# EAGLE design mikroAmpMeterV150_AnalogFrontend (EAGLE 6.3)
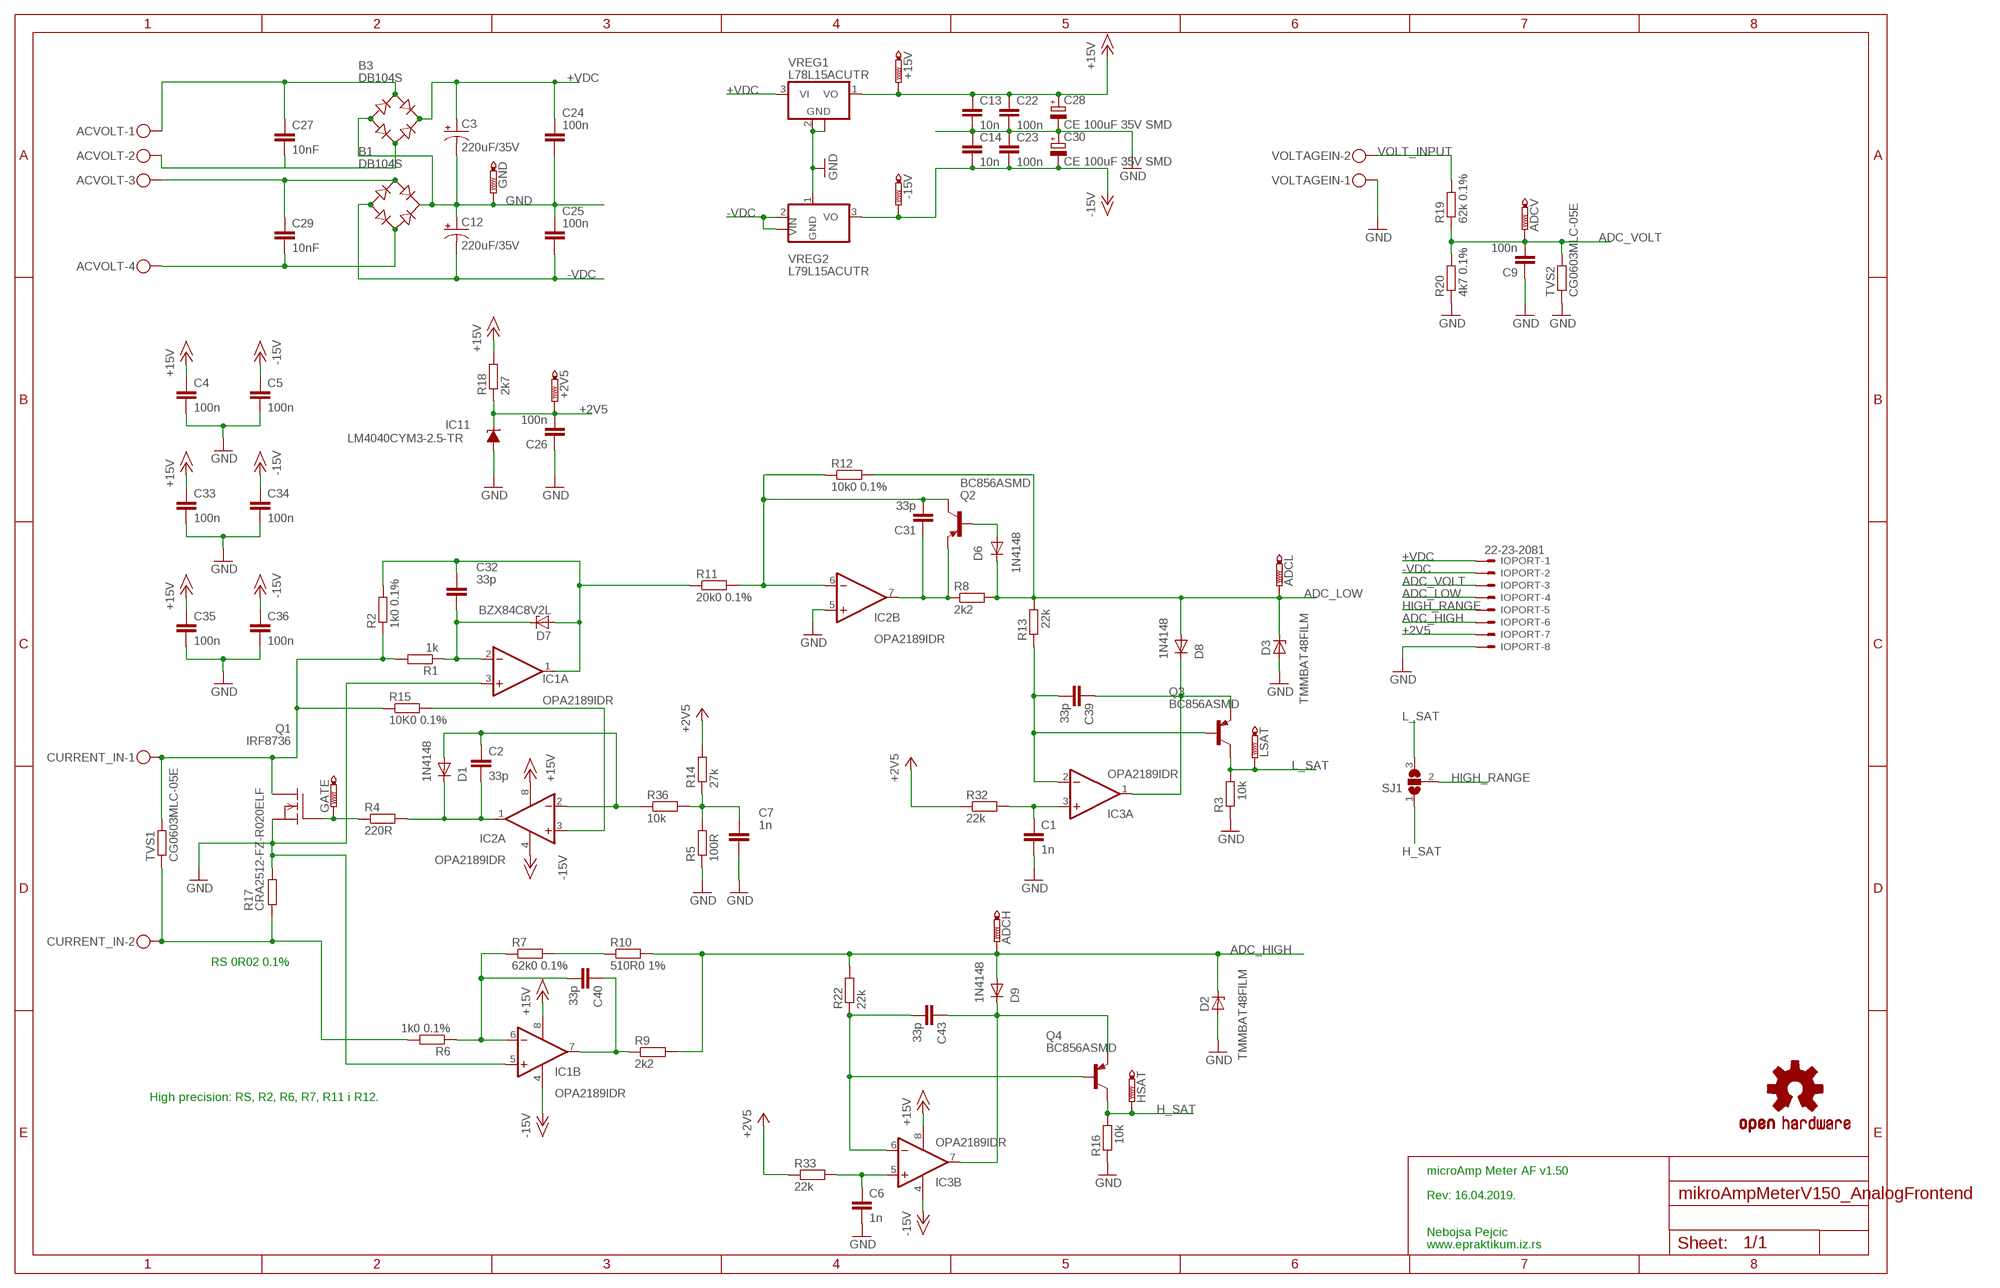
[diagram p0: schematic, sheet 1]

## Parts
+2V5  PTR1TP15R  [TP15R]
+15V  PTR1TP15R  [TP15R]
-15V  PTR1TP15R  [TP15R]
ACVOLT  MKDSN1,5/4-5,08  [MKDSN1,5/4-5,08]
ADCH  PTR1TP15R  [TP15R]
ADCL  PTR1TP15R  [TP15R]
ADCV  PTR1TP15R  [TP15R]
B1  DB104S  DBLS204G  [DBS]
B3  DB104S  DBLS204G  [DBS]
C1  1n  C-EUC0805  [C0805]
C2  33p  C-EUC0805  [C0805]
C3  220uF/35V  CPOL-US153CLV-1014  [153CLV-1014]
C4  100n  C-EUC0805  [C0805]
C5  100n  C-EUC0805  [C0805]
C6  1n  C-EUC0805  [C0805]
C7  1n  C-EUC0805  [C0805]
C9  100n  C-EUC0805  [C0805]
C12  220uF/35V  CPOL-US153CLV-1014  [153CLV-1014]
C13  10n  C-EUC0805  [C0805]
C14  10n  C-EUC0805  [C0805]
C22  100n  C-EUC0805  [C0805]
C23  100n  C-EUC0805  [C0805]
C24  100n  C-EUC0805  [C0805]
C25  100n  C-EUC0805  [C0805]
C26  100n  C-EUC0805  [C0805]
C27  10nF  C-EUC1206  [C1206]
C28  CE 100uF 35V SMD  CPOL-EUUD-6,3X7,7  [UD-6,3X7,7_NICHICON]
C29  10nF  C-EUC1206  [C1206]
C30  CE 100uF 35V SMD  CPOL-EUUD-6,3X7,7  [UD-6,3X7,7_NICHICON]
C31  33p  C-EUC0805  [C0805]
C32  33p  C-EUC0805  [C0805]
C33  100n  C-EUC0805  [C0805]
C34  100n  C-EUC0805  [C0805]
C35  100n  C-EUC0805  [C0805]
C36  100n  C-EUC0805  [C0805]
C39  33p  C-EUC0805  [C0805]
C40  33p  C-EUC0805  [C0805]
C43  33p  C-EUC0805  [C0805]
CURRENT_IN  MKDSN1,5/2-5,08  [MKDSN1,5/2-5,08]
D1  1N4148  DIODE-SOD80C  [SOD80C]
D2  TMMBAT48FILM  ZENER-DIODESOD80C  [SOD80C]
D3  TMMBAT48FILM  ZENER-DIODESOD80C  [SOD80C]
D6  1N4148  DIODE-SOD80C  [SOD80C]
D7  BZX84C8V2L  ZENER-DIODESOD80C  [SOD80C]
D8  1N4148  DIODE-SOD80C  [SOD80C]
D9  1N4148  DIODE-SOD80C  [SOD80C]
GATE  PTR1TP15R  [TP15R]
GND  PTR1TP15R  [TP15R]
HSAT  PTR1TP15R  [TP15R]
IC1  OPA2189IDR  OPA2227D  [SO08@1]
IC2  OPA2189IDR  OPA2227D  [SO08@1]
IC3  OPA2189IDR  OPA2227D  [SO08@1]
IC11  LM4040CYM3-2.5-TR  LM4041A12DBZ  [DBZ_R-PDSO-G3]
IOPORT  22-23-2081  [22-23-2081]
LOGO1  OSHW-LOGOM  [OSHW-LOGO-M]
LSAT  PTR1TP15R  [TP15R]
Q1  IRF8736  FDS5680  [SO-8]
Q2  BC856ASMD  [SOT23-BEC]
Q3  BC856ASMD  [SOT23-BEC]
Q4  BC856ASMD  [SOT23-BEC]
R1  1k  R-EU_R0805  [R0805]
R2  1k0 0.1%  R-EU_R0805  [R0805]
R3  10k  R-EU_R0805  [R0805]
R4  220R  R-EU_R0805  [R0805]
R5  100R  R-EU_R0805  [R0805]
R6  1k0 0.1%  R-EU_R0805  [R0805]
R7  62k0 0.1%  R-EU_R0805  [R0805]
R8  2k2  R-EU_R0805  [R0805]
R9  2k2  R-EU_R0805  [R0805]
R10  510R0 1%  R-EU_R0805  [R0805]
R11  20k0 0.1%  R-EU_R0805  [R0805]
R12  10k0 0.1%  R-EU_R0805  [R0805]
R13  22k  R-EU_R0805  [R0805]
R14  27k  R-EU_R0805  [R0805]
R15  10K0 0.1%  R-EU_R0805  [R0805]
R16  10k  R-EU_R0805  [R0805]
R17  CRA2512-FZ-R020ELF  R-EU_R2512  [R2512]
R18  2k7  R-EU_R0805  [R0805]
R19  62k 0.1%  R-EU_R0805  [R0805]
R20  4k7 0.1%  R-EU_R0805  [R0805]
R22  22k  R-EU_R0805  [R0805]
R32  22k  R-EU_R0805  [R0805]
R33  22k  R-EU_R0805  [R0805]
R36  10k  R-EU_R0805  [R0805]
SJ1  SJ2W  [SJ_2]
TVS1  CG0603MLC-05E  R-EU_R0805  [R0805]
TVS2  CG0603MLC-05E  R-EU_R0805  [R0805]
VOLTAGEIN  MKDSN1,5/2-5,08  [MKDSN1,5/2-5,08]
VREG1  L78L15ACUTR  78L05F  [SOT89]
VREG2  L79L15ACUTR  [SOT89]

## Nets
+2V5: +2V5.TP C26.2 IC11.1(C) IOPORT.7 R14.2 R18.1 R32.1 R33.1
+15V: +15V.TP C4.1 C13.1 C22.1 C28.+ C33.1 C35.1 IC1.8(P:V+) IC2.8(P:V+) IC3.8(P:V+) R18.2 VREG1.1(VO)
+VDC: B3.+ C3.+ C24.2 IOPORT.1 VREG1.3(VI)
-15V: -15V.TP C5.1 C14.2 C23.2 C30.- C34.1 C36.1 IC1.4(P:V-) IC2.4(P:V-) IC3.4(P:V-) VREG2.3(VO)
-VDC: B1.- C12.- C25.1 IOPORT.2 VREG2.2(VIN) VREG2.2@1(VIN)
ADC_HIGH: ADCH.TP D2.C D9.A IOPORT.6 R9.2 R10.2 R22.2
ADC_LOW: ADCL.TP D3.C D6.C D8.A IOPORT.4 R8.2 R12.2 R13.2
ADC_VOLT: ADCV.TP C9.2 IOPORT.3 R19.1 R20.2 TVS2.2
CIN+: CURRENT_IN.1 Q1.5(D) Q1.6(D) Q1.7(D) Q1.8(D) R1.2 R2.1 R15.1 TVS1.2
CIN-: CURRENT_IN.2 R6.2 R17.1 TVS1.1
GND: B1.+ B3.- C1.2 C3.- C4.2 C5.2 C6.2 C7.2 C9.1 C12.+ C13.2 C14.1 C22.2 C23.1 C24.1 C25.2 C26.1 C28.- C30.+ C33.2 C34.2 C35.2 C36.2 D2.A D3.A GND.TP IC1.3(A:+IN) IC1.5(B:+IN) IC2.5(B:+IN) IC11.2(A) IOPORT.8 Q1.1(S) Q1.2(S) Q1.3(S) R3.1 R5.1 R16.1 R17.2 R20.1 TVS2.1 VOLTAGEIN.1 VREG1.2(GND) VREG1.2@1(GND) VREG2.1(GND)
H_SAT: HSAT.TP Q4.C R16.2 SJ1.1
HIGH_RANGE: IOPORT.5 SJ1.2
L_SAT: LSAT.TP Q3.C R3.2 SJ1.3
N$1: C7.1 R5.2 R14.1 R36.2
N$2: C32.2 D7.C IC1.2(A:-IN) R1.1
N$3: C2.1 D1.A IC2.2(A:-IN) R36.1
N$5: D6.A Q2.B
N$6: IC2.3(A:+IN) R15.2
N$7: C43.2 IC3.6(B:-IN) Q4.B R22.1
N$18: C32.1 D7.A IC1.1(A:OUT) R2.2 R11.1
N$19: C31.2 IC2.6(B:-IN) Q2.C R11.2 R12.1
N$21: C31.1 IC2.7(B:OUT) Q2.E R8.1
N$22: C39.2 IC3.2(A:-IN) Q3.B R13.1
N$26: ACVOLT.1 B3.AC1 C27.2
N$28: ACVOLT.2 B3.AC2 C27.1
N$29: ACVOLT.3 B1.AC1 C29.2
N$30: ACVOLT.4 B1.AC2 C29.1
N$39: GATE.TP Q1.4(G) R4.1
N$40: C2.2 D1.C IC2.1(A:OUT) R4.2
N$47: C39.1 D8.C IC3.1(A:OUT) Q3.E
N$48: C40.2 IC1.6(B:-IN) R6.1 R7.1
N$49: R7.2 R10.1
N$50: C40.1 IC1.7(B:OUT) R9.1
N$53: C43.1 D9.C IC3.7(B:OUT) Q4.E
N$55: C6.1 IC3.5(B:+IN) R33.2
N$56: C1.1 IC3.3(A:+IN) R32.2
VOLT_INPUT: R19.2 VOLTAGEIN.2

## Notes on the sheet
- RS 0R02 0.1%
- High precision: RS, R2, R6, R7, R11 i R12.
- microAmp Meter AF v1.50
- Rev: 16.04.2019.
- Nebojsa Pejcic
- www.epraktikum.iz.rs

## Library data of the parts
+2V5 +15V -15V ADCH ADCL ADCV GATE GND HSAT LSAT = testpad:PTR1: TEST PIN
ACVOLT = con-phoenix-508:MKDSN1,5/4-5,08: MKDSN 1,5/ 4-5,08 Printklemme Nennstrom: 13,5 A Nennspannung: 250 V Rastermaß: 5,08 mm Polzahl: 4 Anschlussart: Schraubanschluss Montage: Löten Anschlussrichtung Leiter/Platine: 0 ° Artikelnummer: 1729144 Source: http://eshop.phoenixcontact.com .. 1729144.pdf; MPN: SMKDSN1,5/4-5,08; OC_FARNELL: 1792905; OC_NEWARK: 70R0300
B1 B3 = rectifier:DB?*G: Single Phase 1.0 AMP Glass Passivated Bridge Rectifier Taiwan Semiconductor Co.,Ltd. - TSC Source: http://www.taiwansemi.com/TSCbig5/ezcatfiles/cust/img/img/db101g.pdf http://www.ts.com.tw/db/pictures/modules/PDT/PDT060207001/DBLS201G.pdf
C1 C2 C4-C7 C9 C13 C14 C22-C27 C29 C31-C36 C39 C40 C43 = rcl:C-EU: CAPACITOR, European symbol
C3 C12 = rcl:CPOL-US: POLARIZED CAPACITOR, American symbol
C28 C30 = rcl:CPOL-EU: POLARIZED CAPACITOR, European symbol
CURRENT_IN VOLTAGEIN = con-phoenix-508:MKDSN1,5/2-5,08: MKDSN 1,5/ 2-5,08 Printklemme Nennstrom: 13,5 A Nennspannung: 250 V Rastermaß: 5,08 mm Polzahl: 2 Anschlussart: Schraubanschluss Montage: Löten Anschlussrichtung Leiter/Platine: 0 ° Artikelnummer: 1729128 Source: http://eshop.phoenixcontact.com .. 1729128.pdf; MPN: MKDSN 1,5/2-5.08; OC_FARNELL: 1792903; OC_NEWARK: 30M2397
D1 D6 D8 D9 = diode:DIODE-: DIODE
D2 D3 D7 = diode:ZENER-DIODE: Z-Diode
IC1-IC3 = linear:OPA222*: High Precision, Low Noise OPERATIONAL AMPLIFIERS Source: http://focus.ti.com/lit/ds/symlink/opa227.pdf
IC11 = texas:LM4041: PRECISION MICROPOWER SHUNT VOLTAGE REFERENCE Source: http://focus.ti.com/lit/ds/slcs146e/slcs146e.pdf; MPN: LM4041A12IDBZR; OC_FARNELL: 1407949; OC_NEWARK: 58K5875
IOPORT = con-molex:22-23-2081: .100" (2.54mm) Center Header - 8 Pin; MF: MOLEX; MPN: 22-23-2081; OC_FARNELL: 1756826; OC_NEWARK: 01C7592
LOGO1 = SparkFun-Aesthetics:OSHW-LOGO: Open Source Hardware Logo This logo indicates the piece of hardware it is found on incorporates a OSHW license and/or adheres to the definition of open source hardware found here: http://freedomdefined.org/OSHW
Q1 = transistor-fet:FDS5680: 60V N-Channel PowerTrench TM MOSFET FAIRCHILD FDS5680.pdf
Q2-Q4 = transistor-pnp:BC856*: PNP Transistror
R1-R20 R22 R32 R33 R36 TVS1 TVS2 = rcl:R-EU_: RESISTOR, European symbol
SJ1 = jumper:SJ2W: SMD solder JUMPER
VREG1 = linear:78L*: POSITOIV-VOLTAGE REGULATORS Output up to 100 mA Source: http://focus.ti.com/lit/ds/symlink/ua78l05.pdf
VREG2 = linear:L79L15ACUTR

## Board
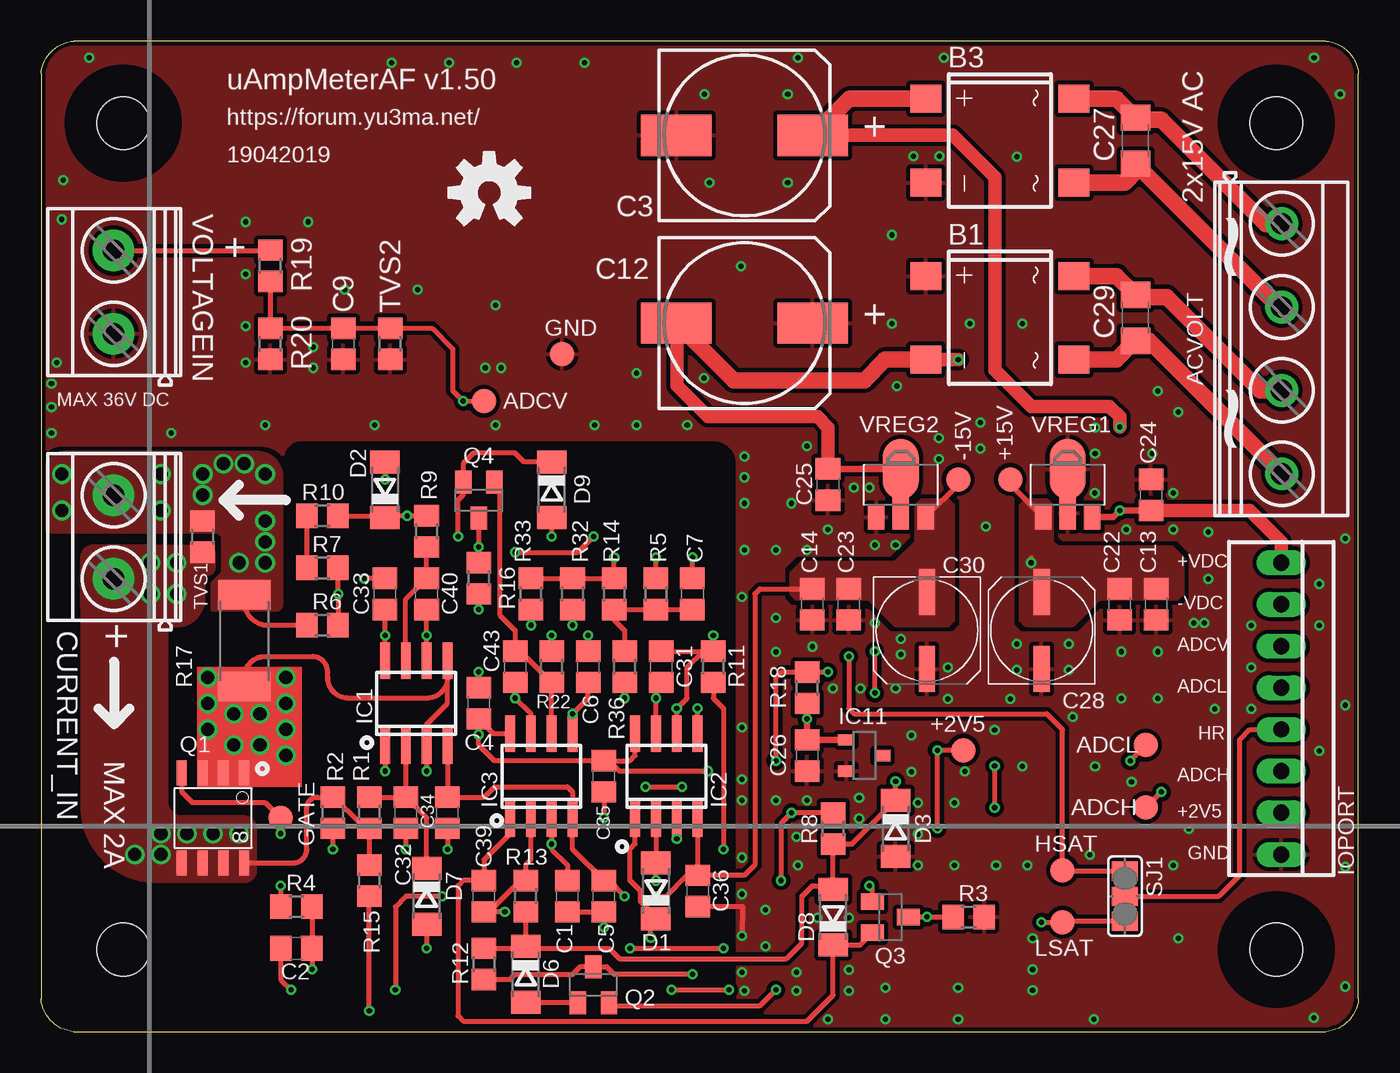
[diagram p1: board, top side]
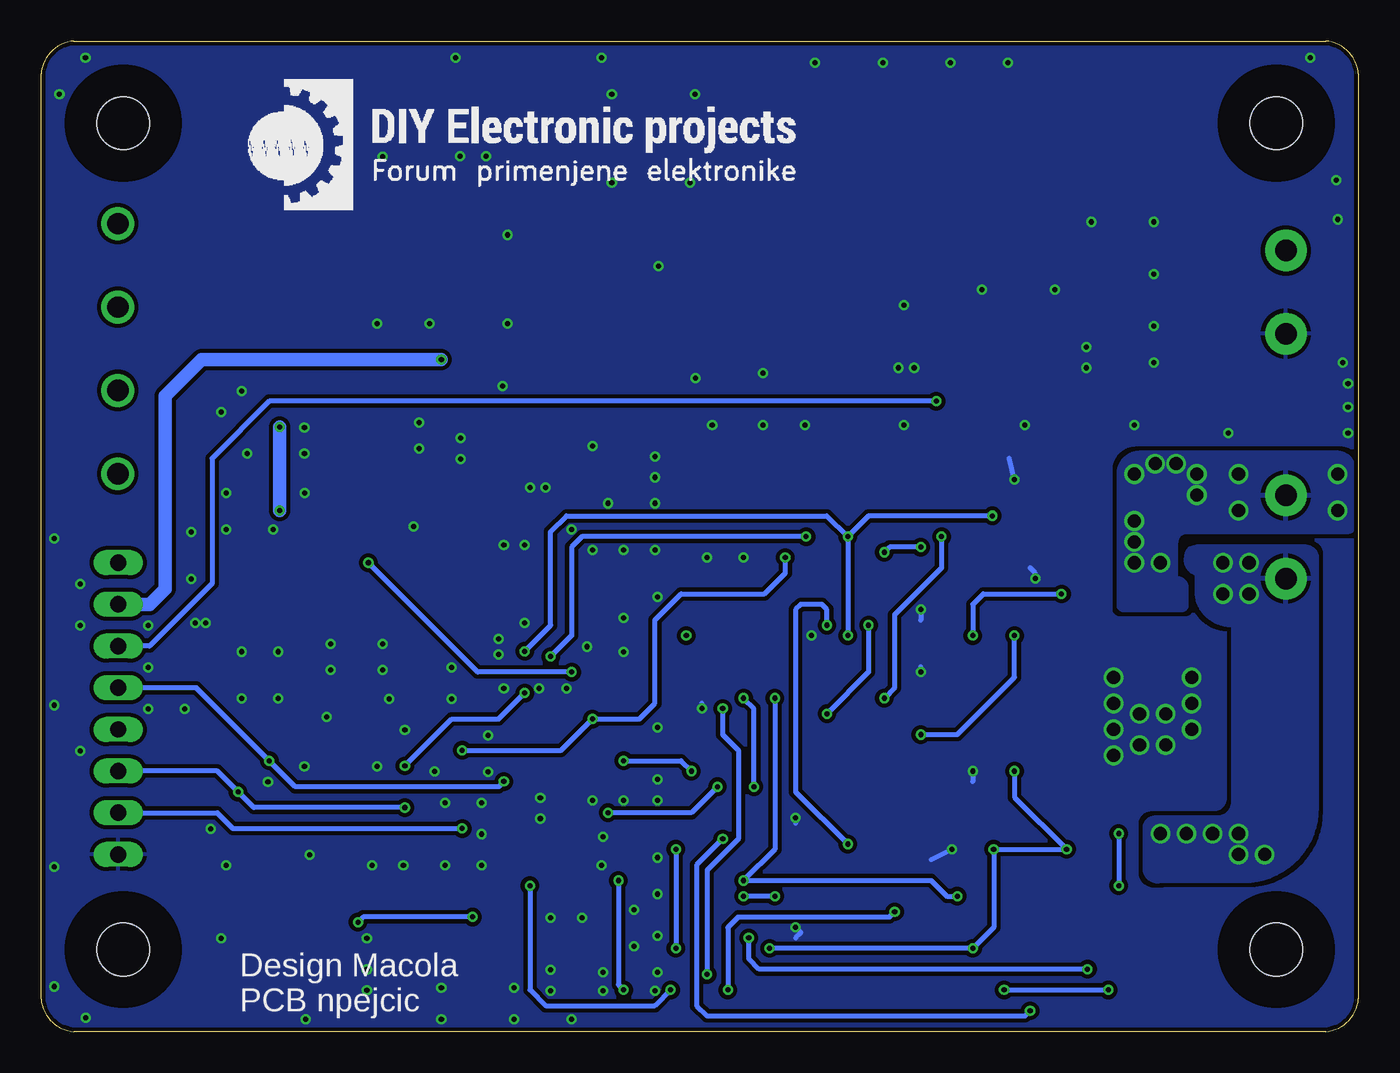
[diagram p2: board, bottom side, seen from below]

Size 80.27 x 60.36 mm. Coordinates in mm from the lower left corner, seen from the top.
Outline: 2,0 78.27,0 arc81 80.27,2 80.27,58.36 arc81 78.27,60.36 2,60.36 arc81 0,58.36 0,2 arc81 2,0
Copper layers (1*16): Top 0.035mm / dielectric 1.5mm / Bottom 0.035mm
Design rules "ITEADstudio_DRC": minimum track width 6mil, minimum drill 12mil, track to track 6mil, track to pad 6mil, pad to pad 6mil, via to via 6mil, smd to smd 0mil, copper to edge 10mil, drill to drill 10mil, minimum pad ring 10mil, minimum via ring 6mil, stop-mask expansion 2mil, vias tented up to drill 100mil, thermal gap 10mil
Holes 3.2 mm at 75.27,55.36 5,55.36 75.27,5 5,5
tRestrict: area 2,2 to 8,8; area 72.3,52.4 to 78.3,58.4; area 2,52.4 to 8,58.4; area 72.3,2 to 78.3,8; area 8.3,0 to 41.9,35.6
bRestrict: area 2,2 to 8,8; area 72.3,52.4 to 78.3,58.4; area 2,52.4 to 8,58.4; area 72.3,2 to 78.3,8

### Footprints (pad centres in the part's own frame; a part is rotated, then mirrored left to right if it is on the bottom)
TP15R = smd 1.5 x 1.5: TP 0,0
MKDSN1,5/4-5,08 = drill 1.3 pad 2: 1 -7.641,0.025; 2 -2.561,0.025; 3 2.519,0.025; 4 7.599,0.025
DBS = smd 1.7 x 1.9: + -2.55,-4.5; - 2.55,-4.5; AC1 -2.55,4.5; AC2 2.55,4.5
C0805 = smd 1.3 x 1.5: 1 -0.95,0; 2 0.95,0
153CLV-1014 = smd 4.3 x 2.5: + 4.15,0; - -4.15,0
C1206 = smd 1.6 x 1.8: 1 -1.4,0; 2 1.4,0
UD-6,3X7,7_NICHICON = smd 2.8 x 1: + 2.35,0; - -2.35,0
MKDSN1,5/2-5,08 = drill 1.3 pad 2.54: 1 -2.561,0.025; 2 2.519,0.025
SOD80C = smd 1.4 x 1.8: A 1.7,0; C -1.7,0
SO08@1 = smd 0.6 x 2.2: 1 -1.905,-2.6; 2 -0.635,-2.6; 3 0.635,-2.6; 4 1.905,-2.6; 5 1.905,2.6; 6 0.635,2.6; 7 -0.635,2.6; 8 -1.905,2.6
DBZ_R-PDSO-G3 = smd 0.7 x 1: 1 -0.95,-1.1; 2 0.95,-1.1; 3 0,1.1
22-23-2081 = drill 1 long: 1 -8.89,0; 2 -6.35,0; 3 -3.81,0; 4 -1.27,0; 5 1.27,0; 6 3.81,0; 7 6.35,0; 8 8.89,0
SO-8 = smd 1.524 x 0.61: 1 -2.743,1.905; 2 -2.743,0.635; 3 -2.743,-0.635; 4 -2.743,-1.905; 5 2.743,-1.905; 6 2.743,-0.635; 7 2.743,0.635; 8 2.743,1.905
SOT23-BEC = smd 1 x 1.4: B -0.95,-1.1; C 0,1.1; E 0.95,-1.1
R0805 = smd 1.3 x 1.5: 1 -0.95,0; 2 0.95,0
R2512 = smd 1.8 x 3.2: 1 -2.8,0; 2 2.8,0
SJ_2 = smd 1.168 x 1.6: 1 -1.524,0; 2 0,0; 3 1.524,0
SOT89 = smd 1 x 1.5: 1 -1.499,-1.981; 3 1.499,-1.981 | smd 1 x 2: 2 0,-1.727 | smd 2.2 x 3.7: 2@1 0,0.94

### Placement (x,y rotation side)
+2V5  56.2,17.14 0 top
+15V  59.05,33.66 0 top
-15V  55.88,33.66 0 top
ACVOLT  75.56,41.59 270 top
ADCH  67.31,13.65 0 top
ADCL  67.31,17.46 0 top
ADCV  26.99,38.42 0 top
B1  58.42,43.5 270 top
B3  58.42,54.29 270 top
C1  32.07,8.26 270 top
C2  15.56,5.08 0 top
C3  42.86,54.61 0 top
C4  26.67,20 90 top
C5  34.29,8.26 270 top
C6  33.34,22.23 90 top
C7  39.69,26.67 90 top
C9  18.41,41.91 90 top
C12  42.86,43.18 0 top
C13  67.94,26.04 270 top
C14  46.99,26.04 90 top
C22  65.72,26.04 270 top
C23  49.21,26.04 90 top
C24  67.63,32.7 270 top
C25  47.94,33.34 270 top
C26  46.67,16.83 90 top
C27  66.67,54.29 90 top
C28  60.96,24.45 90 top
C29  66.67,43.5 90 top
C30  53.98,24.45 270 top
C31  37.78,22.23 90 top
C32  22.23,13.34 90 top
C33  20.95,26.67 90 top
C34  24.77,13.34 270 top
C35  34.29,15.56 270 top
C36  40.01,8.57 270 top
C39  26.99,8.26 270 top
C40  23.5,26.67 270 top
C43  28.89,22.23 90 top
CURRENT_IN  4.45,30.16 90 top
D1  37.47,8.57 90 top
D2  20.95,33.02 90 top
D3  52.07,12.38 270 top
D6  29.53,3.49 270 top
D7  23.5,8.26 270 top
D8  48.26,6.99 90 top
D9  31.11,33.02 270 top
GATE  14.61,13.02 0 top
GND  31.75,41.27 0 top
HSAT  62.23,9.84 0 top
IC1  22.86,20 0 top
IC2  38.1,15.56 0 top
IC3  30.48,15.56 0 top
IC11  50.16,16.83 270 top
IOPORT  75.56,19.68 270 top
LOGO1  27.3,51.12 0 top
LSAT  62.23,6.67 90 top
Q1  10.48,13.02 270 top
Q2  33.66,2.86 0 top
Q3  51.75,6.99 270 top
Q4  26.67,32.38 180 top
R1  20,13.34 270 top
R2  17.78,13.34 270 top
R3  56.52,6.99 180 top
R4  15.56,7.62 0 top
R5  37.47,26.67 270 top
R6  17.14,24.77 180 top
R7  17.14,28.26 180 top
R8  48.26,12.38 270 top
R9  23.5,30.48 90 top
R10  17.14,31.43 0 top
R11  40.96,22.23 90 top
R12  26.99,4.13 90 top
R13  29.53,8.26 270 top
R14  34.92,26.67 90 top
R15  20,9.21 270 top
R16  26.67,27.62 90 top
R17  12.38,23.81 270 top
R18  46.67,20.95 90 top
R19  13.97,46.67 90 top
R20  13.97,41.91 90 top
R22  31.11,22.23 90 top
R32  32.38,26.67 270 top
R33  29.84,26.67 270 top
R36  35.56,22.23 90 top
SJ1  66.04,8.26 270 top
TVS1  9.84,30.16 270 top
TVS2  21.27,41.91 90 top
VOLTAGEIN  4.45,45.09 90 top
VREG1  62.55,33.34 0 top
VREG2  52.39,33.34 0 top

### Tracks (layer width: path | path; a pad name or v marks a point on that pad's centre or on a via)
+2V5  (via drill 0.31)
  Top 0.305: R18.1 | v54.61,12.38 v54.61,17.14 +2V5.TP | 34.6,27.62 R14.2 | R33.1 R32.1 R14.2 | R14.2 v34.92,28.89
  Top 0.406: R18.1 v46.67,19.05 C26.2 IC11.1
  Bottom 0.305: v34.92,28.89 34.92,27.94 36.2,26.67 41.27,26.67 42.86,25.08 42.86,20 43.81,19.05 v46.67,19.05 48.58,17.14 v54.61,17.14 | IOPORT.7 69.53,13.34 68.58,12.38 v54.61,12.38
+15V  (via drill 0.31)
  Top 0.305: C33.1 v20.95,24.13 IC1.8 | v44.77,16.51 44.77,16.82 44.77,21.59 45.09,21.91 R18.2 v47.94,21.91 | v60.33,28.57 60.33,28.89 | +15V.TP 59.05,33.35 VREG1.1 | IC3.8 27.57,18.16 C4.1 v26.67,18.1 26.67,17.46 27.62,16.51 C35.1 | C35.1 35.88,16.51 36.2,16.83 IC2.8 | C35.1 34.61,16.51 35.24,15.88 v40.64,15.88
  Bottom 0.305: v47.94,21.91 53.66,21.91 v60.33,28.57 | v44.77,16.51 41.27,16.51 v40.64,15.88 | v26.67,18.1 24.45,18.1 20.95,21.59 v20.95,24.13
  pour Top (isolate 0.254, no thermals): 62.87,24.77 60.01,24.77 59.69,25.08 59.69,32.07 60.01,32.38 61.28,32.38 61.59,32.07 61.59,29.84 61.91,29.53 68.9,29.53 69.53,28.89 69.53,26.67 69.22,26.35 64.45,26.35
+VDC  (via drill 0.31)
  Top 0.406: VREG1.3 65.33,31.36 v65.72,31.75 C24.2
  Top 0.813: C24.2 73.66,31.75 75.56,29.84 IOPORT.1 | v65.72,36.83 65.72,37.47 65.09,38.1 60.33,38.1 58.1,40.32 58.1,52.07 55.56,54.61 C3.+
  Top 1.016: B3.+ 49.24,56.84 C3.+
  Bottom 0.813: v65.72,31.75 v65.72,36.83
-15V  (via drill 0.31)
  Top 0.305: IC1.4 C34.1 26.98,14.29 27.62,14.92 32.07,14.92 32.38,14.61 IC3.4 32.38,11.11 C5.1 34.61,9.21 v35.56,8.26 | C14.2 46.35,26.99 43.81,26.99 43.5,26.67 43.5,10.16 42.86,9.53 C36.1 | -15V.TP 55.88,33.35 VREG2.3 | IC2.4 C36.1 | v37.47,8.26 38.1,8.26 39.37,9.53 C36.1
  Bottom 0.305: v35.56,8.26 v37.47,8.26
  pour Top (isolate 0.254, no thermals): 45.72,26.67 45.72,27.94 46.35,28.57 52.07,28.57 53.34,29.84 53.34,32.07 53.66,32.38 55.24,32.38 55.56,32.07 55.56,25.08 55.24,24.77 52.07,24.77 50.48,26.35 46.04,26.35
-VDC  (via drill 0.31)
  Top 0.305: VREG2.2@1 VREG2.2
  Top 0.406: VREG2.2@1 47.96,34.28 C25.1
  Top 0.813: 47.96,34.28 47.96,36.81 47.31,37.47 40.64,37.47 38.73,39.37 38.73,43.16 C12.- | v55.88,40.96 B1.-
  Top 1.016: B1.- 51.42,40.95 50.16,39.69 42.2,39.69 C12.-
  Bottom 0.813: v55.88,40.96 70.48,40.96 72.71,38.73 72.71,26.99 73.66,26.04 IOPORT.2
ADC_HIGH  (via drill 0.31)
  Top 0.305: R9.2 | ADCH.TP v68.26,14.61 | R9.2 | R9.2 v22.3,31.43 | v31.11,24.13 R22.2 | v58.1,13.65 v58.1,16.19 | v50.8,20.64 v50.8,23.18 | D9.A v31.11,30.16 | R10.2 20.84,31.43 D2.C 21.07,31.43 R9.2 | R9.2
  Bottom 0.305: IOPORT.6 69.53,15.88 v68.26,14.61 ADCH.TP v58.1,13.65 | v22.3,31.43 29.84,31.43 v31.11,30.16 | v31.11,30.16 v31.11,24.13 | v58.1,16.19 55.24,19.05 52.39,19.05 v50.8,20.64 | v50.8,23.18 49.21,24.77 49.21,30.48 48.26,31.43 32.38,31.43 v31.11,30.16
ADC_LOW  (via drill 0.31)
  Top 0.305: R12.2 30.36,5.08 | 30.36,5.08 D6.C R13.2 | 30.36,5.08 34.61,5.08 35.24,4.45 45.4,4.45 46.35,5.4 46.35,8.26 46.99,8.89 48.15,8.89 D8.A R8.2 49.42,11.43 D3.C v52.07,15.24 | v66.36,16.51 ADCL.TP
  Bottom 0.305: v52.07,15.24 52.39,14.92 64.77,14.92 v66.36,16.51 70.8,20.95 IOPORT.4
ADC_VOLT  (via drill 0.31)
  Top 0.305: R19.1 R20.2 C9.2 TVS2.2 23.82,42.86 25.08,41.59 25.08,39.05 v25.72,38.42 ADCV.TP
  Bottom 0.305: v25.72,38.42 66.36,38.42 69.85,34.92 69.85,27.3 73.66,23.5 IOPORT.3
CIN+  (via drill 0.8)
  Top 0.305: Q1.8 15.35,10.27 arc90 16.19,11.11 16.19,13.65 arc-90 16.83,14.29 R2.1 arc-90 R2.1 17.86,14.29 19.37,12.78 19.61,12.78 R1.2 R15.1
  other vias: 7.3,10.79 5.71,10.79 8.89,12.06 10.48,12.06 12.06,12.06 7.3,12.06 6.67,28.57 8.26,28.57 6.67,26.67 8.26,26.67
  pour Bottom: 12.06,9.21 6.99,9.21 arc-90 2.54,13.65 2.54,28.82 arc-90 3.25,29.53 9.84,29.53 10.27,29.42 arc-45 10.48,28.92 10.48,28.89 arc-90 9.84,27.94 9.84,26.67 arc-90 7.62,24.82 7.62,13.97 arc90 8.57,13.02 12.38,13.02 arc-90 13.02,12.38 13.02,9.84 arc-90
  pour Top (no thermals): 2.54,26.04 2.54,28.89 arc-90 3.17,29.53 10.16,29.53 arc-90 10.48,29.21 10.48,28.26 arc-90 10.16,27.94 arc90 9.84,27.62 9.84,26.35 arc-90 8.26,24.77 3.81,24.77 arc-90
  pour Top (no thermals): 2.54,28.89 2.54,13.86 arc90 6.87,9.21 12.38,9.21 arc90 13.02,9.84 13.02,12.38 arc90 12.38,13.02 8.57,13.02 arc-90 7.62,13.97 7.62,28.26 arc90 6.35,29.53 3.17,29.53 arc90
CIN-  (via drill 0.8)
  Top 0.305: R6.2 13.6,24.77 arc-90 R17.1
  Top 1.27: TVS1.1
  Top 1.676: 12.32,26.67 R17.1
  other vias: 1.27,33.97 1.27,31.75 7.3,31.75 7.3,33.97 9.84,33.97 9.84,32.7 11.11,34.61 12.06,28.57 13.65,28.57 13.65,29.84 13.65,31.11 13.65,33.97 12.38,34.61
  pour Top (no thermals): 10.48,27.3 11.11,27.94 11.11,30.16 10.79,30.48 0.64,30.48 arc-90 0.32,30.8 0.32,34.1 arc-90 1.46,35.24 13.19,35.24 arc-90 14.61,33.82 14.61,26.04 arc-90 14.29,25.72 10.48,25.72
  pour Bottom: 0.32,30.8 0.32,34.29 arc-90 1.27,35.24 13.34,35.24 arc-90 14.61,33.97 14.61,26.04 arc-90 14.29,25.72 10.79,25.72 arc-90 10.48,26.04 10.48,26.99 arc-90 11.11,27.62 11.11,29.84 arc90 10.48,30.48 0.64,30.48 arc-90
GND  (via drill 0.31, 0.8)
  Top 0.305: R17.2 12.38,21.59 arc-90 13.65,22.86 16.51,22.86 arc-90 17.46,21.91 17.46,21.59 arc90 18.73,20.32 23.5,20.32 arc90 24.77,21.59 | IC1.5 24.77,21.59 | 24.77,21.59 24.77,20 23.5,18.73 IC1.3 v23.5,15.88 | C33.2 v19.69,27.62 v19.68,27.62 | C34.2 v24.77,11.11 | D2.A v20.95,33.66 | Q1.3 Q1.2 | C4.2 v26.67,21.91 | R16.1 v26.67,25.72 | C6.2 v33.34,24.13 | v34.29,6.35 C5.2 C1.2 | R5.1 v37.47,28.89 | C7.2 v39.69,28.89 | IC2.5 v40.01,19.68 | C36.2 42.74,7.62 v42.7,5.84 | C35.2 v34.29,13.02
  Top 1.676: Q1.2 Q1.1 R17.2
  Bottom 0.305: v34.29,6.35 33.97,6.03 34.29,5.71 | v23.5,15.88 23.5,15.24 | v19.68,27.62 19.68,27.94 20,28.26 | v24.77,11.11 26.04,10.48 | v20.95,33.66 21.27,34.92 | v26.67,21.91 26.67,22.23 | v26.67,25.72 26.67,25.08 | v40.01,19.68 40.01,20 | v34.29,13.02 34.29,12.7
  other vias: 46.67,29.34 50.8,29.65 46.67,35.69 42.86,29.34 45.72,32.19 39.37,36.96 0.64,39.5 27.7,36.96 42.86,35.05 52.07,29.65 2.95,59.35 0.95,40.77 1.27,49.49 0.64,38.06 0.64,36.47 33.73,36.96 50.48,33.15 44.77,29.34 42.86,33.78 49.53,33.15 42.86,32.19 53.15,53.34 54.74,53.34 33.11,59.03 28.98,59.03 24.85,59.03 21.36,59.03 46.13,59.35 55.02,59.35 77.56,59.35 79.15,57.12 42.7,26.48 44.77,25.21 44.77,14.1 62.87,19.18 52.39,23.94 52.39,22.99 50.8,24.89 42.7,18.54 42.7,15.37 42.7,14.1 42.7,10.6 46.67,14.1 46.04,11.87 42.7,8.38 44.13,7.43 44.13,5.21 42.7,3.62 77.55,0.84 79.45,2.75 79.45,10.05 79.45,19.89 79.45,30.05 20.32,36.96 13.65,36.96 46.04,3.62 47.94,0.76 51.44,0.76 55.88,0.76 64.14,0.76 40.73,51.73 45.49,51.73 45.49,57.12 40.41,57.12 51.84,48.55 51.84,43.15 56.6,43.15 59.78,43.15 59.46,53.31 42.63,46.65 52.16,39.34 54.7,36.17 54.7,34.9 57.56,30.77 57.24,37.12 57.24,35.53 64.22,36.8 64.22,35.22 67.72,35.22 68.03,39.03 69.3,37.76 65.81,23.15 68.03,23.15 68.03,20.29 65.81,20.29 56.29,15.85 59.78,16.17 64.22,16.17 71.53,19.66 73.75,19.66 73.75,22.2 73.75,24.74 77.88,27.28 77.88,24.74 77.88,17.12 63.91,10.77 69.3,5.69 68.99,10.13 69.94,12.36 66.45,15.21 53.43,13.94 53.43,12.04 55.65,13.94 58.19,10.13 60.1,10.13 60.41,5.69 60.41,3.78 60.41,2.51 46.13,10.13 53.43,10.13 55.65,10.13 27.7,44.26 1.35,51.88 12.46,49.34 16.27,49.34 18.49,45.21 27.07,40.45 22.94,45.21 28.02,40.45 36.27,40.13 36.27,36.96 40.4,39.81 16.59,41.72 16.59,40.45 12.46,46.16 12.46,42.99 12.46,40.77 62.63,23.62 62.63,22.03 59.45,22.03 59.45,23.62 66.12,30.61 68.98,30.61 68.98,32.83 64.21,32.83 70.25,24.89 70.88,24.89 55.88,2.67 51.44,2.67 10.16,21.59 10.16,20 10.16,18.41 11.75,19.37 11.75,17.46 13.34,19.37 13.34,17.46 14.92,16.83 14.92,18.41 14.92,20 14.92,21.59 7.94,36.47 42.86,2.5 46.04,2.5 49.21,2.5 49.21,3.77 47.31,6.95 49.21,6.95 49.85,14.25 49.85,12.98 53.02,18.06 53.02,15.84 58.1,18.38 55.24,20.28 59.05,20.28 55.24,22.19 52.07,20.92 48.26,20.92 44.77,23.14 46.99,23.46 71.12,30.44 71.12,27.58 47.94,30.61 49.93,20.92
  pour Top (isolate 0.254, rank 2): -0.44,60.77 80.33,60.77 80.64,-0.32 59.37,-0.32 58.42,-0.25 -0.44,-0.25
  pour Bottom (isolate 0.254, rank 2): -0.44,60.77 -0.44,-0.25 57.47,-0.25 58.1,-0.32 80.64,-0.32 80.33,60.77
H_SAT  (via drill 0.31)
  Top 0.305: Q4.C v26.67,29.53 R16.2 | v28.89,29.21 32.7,29.21 v33.66,30.16 | v49.21,22.86 49.21,19.68 49.53,19.37 61.28,19.37 62.23,18.41 HSAT.TP 62.29,9.78 SJ1.1
  Bottom 0.305: v26.67,29.53 28.57,29.53 v28.89,29.21 | v33.66,30.16 47.31,30.16 47.94,29.53 47.94,24.13 v49.21,22.86
HIGH_RANGE
  Top 0.305: SJ1.2 71.75,8.26 73.03,9.53 73.03,17.78 73.66,18.41 IOPORT.5
L_SAT  (via drill 0.31)
  Top 0.305: Q3.C v53.98,6.99 R3.2 | v60.96,6.67 LSAT.TP 62.29,6.73 SJ1.3
  Bottom 0.305: v53.98,6.99 60.64,6.99 v60.96,6.67
N$1
  Top 0.305: R36.2 35.56,24.45 34.92,25.08 R14.1 R5.2 C7.1
N$2
  Top 0.305: IC1.2 C32.2 | R1.1 C32.2 | D7.C 23.5,13.02 C32.2
N$3  (via drill 0.31)
  Top 0.305: C2.1 14.61,3.17 v15.24,2.54 | v37.47,9.21 D1.A IC2.2 | R36.1 v35.56,20.32 | v24.45,8.26 22.23,8.26 21.59,7.62 v21.59,2.54
  Bottom 0.305: v35.56,20.32 35.56,11.11 v37.47,9.21 26.04,9.21 25.08,8.26 v24.45,8.26 | v21.59,2.54 v15.24,2.54
N$5
  Top 0.305: D6.A 32.67,1.79 Q2.B
N$6  (via drill 0.31)
  Top 0.305: IC2.3 v38.73,11.75 | v20,1.27 R15.2
  Bottom 0.305: v38.73,11.75 40.32,10.16 40.32,1.59 39.69,0.95 20.32,0.95 v20,1.27
N$7
  Top 0.305: IC3.6 R22.1 29.21,23.18 C43.2 28.89,24.45 27.94,25.4 27.94,33.02 27.62,33.34 Q4.B
N$18  (via drill 0.31)
  Top 0.305: R2.2 v17.78,11.11 | C32.1 v22.23,11.11 | 23.38,6.67 D7.A v23.5,5.08 | v35.88,5.08 v41.59,5.08 | R11.1 40.96,20.32 41.59,19.68 v41.59,11.11 | IC1.1 v20.95,15.88
  Bottom 0.305: v20.95,15.88 20.95,14.29 v17.78,11.11 v22.23,11.11 22.23,6.35 v23.5,5.08 v35.88,5.08 | v41.59,11.11 v41.59,5.08
N$19  (via drill 0.31)
  Top 0.305: v40.96,24.13 R11.2 40.32,23.18 | R12.1 28.58,3.18 28.89,3.49 32.38,3.49 32.85,3.96 Q2.C 34.46,3.96 34.92,3.49 v39.69,3.49 | C31.2 40.32,23.18 | IC2.6 v38.73,19.68 39.37,20.32 39.37,22.22 40.32,23.18
  Bottom 0.305: v38.73,19.68 38.73,18.1 37.78,17.14 37.78,11.75 39.69,9.84 v39.69,3.49
N$21  (via drill 0.31)
  Top 0.305: R8.1 46.04,13.33 | 46.04,13.33 v45.72,13.33 45.09,12.7 v45.09,9.21 | v44.77,2.54 43.81,1.59 34.77,1.59 Q2.E | IC2.7 v37.47,20.32 37.47,20.95 C31.1 | v36.83,14.92 v39.05,14.92 | v45.72,13.34 46.03,13.34 46.04,13.33
  Bottom 0.305: v37.47,20.32 36.83,19.68 v36.83,14.92 | v45.09,9.21 45.09,2.86 v44.77,2.54 | v39.05,14.92 40.64,13.34 v45.72,13.34 v45.72,13.33
N$22  (via drill 0.31)
  Top 0.305: IC3.2 29.84,10.48 29.53,10.16 R13.1 | R13.1 29.21,8.89 28.89,8.89 27.31,7.3 C39.2 v28.26,7.3 | Q3.B 50.65,8.72 v50.48,8.89 | R13.1 29.85,9.21 | v38.42,2.54 v41.91,2.54
  Bottom 0.305: v50.48,8.89 50.48,2.54 49.53,1.59 42.86,1.59 v41.91,2.54 | v38.42,2.54 38.42,6.35 37.78,6.99 28.57,6.99 v28.26,7.3
N$26
  Top 1.016: B3.AC1 65.53,56.84 C27.2 66.81,55.56 68.26,55.56 74.61,49.21 75.57,49.21 ACVOLT.1
N$28
  Top 1.016: B3.AC2 66.03,51.74 66.67,52.39 C27.1 75.44,44.13 75.57,44.13 ACVOLT.2
N$29
  Top 1.016: B1.AC1 65.53,46.05 C29.2 66.81,44.77 68.58,44.77 74.3,39.05 75.57,39.05 ACVOLT.3
N$30
  Top 1.016: B1.AC2 65.53,40.95 C29.1 67.49,42.1 ACVOLT.4
N$39  (via drill 0.31)
  Top 0.305: Q1.4 8.57,14.61 9.21,13.97 13.65,13.97 GATE.TP v14.61,12.06 | v14.61,8.89 R4.1
  Bottom 0.305: v14.61,12.06 v14.61,8.89
N$40  (via drill 0.31)
  Top 0.305: R4.2 C2.2 16.51,4.45 v16.51,3.81 | v37.15,5.71 37.15,6.55 D1.C 37.47,6.99 36.51,7.94 36.51,8.57 35.88,9.21 35.88,11.11 36.2,11.43 IC2.1
  Bottom 0.305: v16.51,3.81 36.51,3.81 37.15,4.45 v37.15,5.71
N$47
  Top 0.305: IC3.1 28.57,12.06 26.99,10.48 C39.1 | C39.1 | C39.1 25.72,9.21 25.4,8.89 25.4,0.95 25.72,0.64 46.67,0.64 48.26,2.22 D8.C 49.9,5.29 Q3.E
N$48  (via drill 0.31)
  Top 0.305: IC1.6 v23.5,24.13 C40.2 | R7.1 v18.09,26.67 R6.1
  Bottom 0.305: v23.5,24.13 23.5,26.04 22.86,26.67 v18.09,26.67
N$49
  Top 0.305: R10.1 R7.2
N$50
  Top 0.305: R9.1 C40.1 22.23,26.35 IC1.7
N$53  (via drill 0.31)
  Top 0.305: C43.1 v28.89,20.32 29.84,19.37 IC3.7 | D9.C 29.41,34.72 28.89,35.24 26.35,35.24 25.72,34.61 Q4.E 25.72,32.7 25.4,32.38 v25.4,30.16
  Bottom 0.305: v25.4,30.16 25.4,28.26 28.26,25.4 28.26,20.95 v28.89,20.32
N$55  (via drill 0.31)
  Top 0.305: IC3.5 v32.38,19.37 33.34,20.32 C6.1 | R33.2 v29.84,24.77
  Bottom 0.305: v29.84,24.77 29.84,21.91 v32.38,19.37
N$56  (via drill 0.31)
  Top 0.305: IC3.3 v31.11,11.43 31.11,11.11 32.07,10.16 C1.1 | R32.2 v32.38,24.77
  Bottom 0.305: v32.38,24.77 R32.2 32.7,26.04 33.97,26.04 34.29,25.72 34.29,14.61 v31.11,11.43
VOLT_INPUT
  Top 0.305: VOLTAGEIN.2 13.95,47.6 R19.2
(copper drawn outside any net)
  shapes: Top area x1

### Text on the board
tPlace: + | 2x15V AC | + | ~ | + | MAX 36V DC | ~ | +VDC | -VDC | + | ADCV | ADCL | HR | MAX 2A | ADCH | +2V5 | GND
bPlace: Design Macola / PCB npejcic
tNames: uAmpMeterAF v1.50 | https://forum.yu3ma.net/ | 19042019